# Altium schematic sheet IO.SchDoc: User IO
size A4; Organization: BME AUT; Address1: Magyar tudósok krt. 2.; Address2: Q épület; Address3: Budapest; Address4: H-1117; DocumentNumber: 1; Revision: 1.0; SheetNumber: 1; SheetTotal: 2
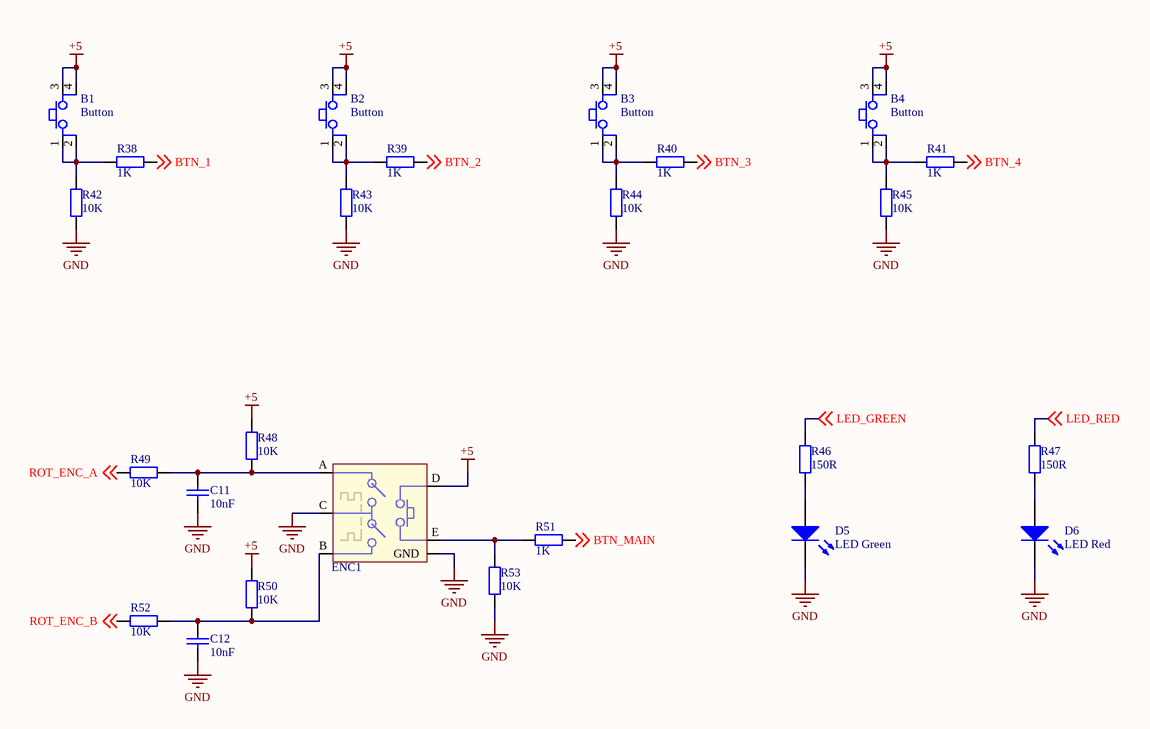
[diagram p0: IO.SchDoc]

## Parts
B1  Button  [FP_BTN_SMD]
B2  Button  [FP_BTN_SMD]
B3  Button  [FP_BTN_SMD]
B4  Button  [FP_BTN_SMD]
C11  10nF  [FP_0805_CAP_085]
C12  10nF  [FP_0805_CAP_085]
D5  LED Green  [FP_0805_LED_RED]
D6  LED Red  [FP_0805_LED_RED]
ENC1  Rotary Encoder  [FP_PEC11S]  (value not drawn)
R38  1K  [FP_0805_RES]
R39  1K  [FP_0805_RES]
R40  1K  [FP_0805_RES]
R41  1K  [FP_0805_RES]
R42  10K  [FP_0805_RES]
R43  10K  [FP_0805_RES]
R44  10K  [FP_0805_RES]
R45  10K  [FP_0805_RES]
R46  150R  [FP_0805_RES]
R47  150R  [FP_0805_RES]
R48  10K  [FP_0805_RES]
R49  10K  [FP_0805_RES]
R50  10K  [FP_0805_RES]
R51  1K  [FP_0805_RES]
R52  10K  [FP_0805_RES]
R53  10K  [FP_0805_RES]

## Nets
+5: B1.3 B1.4 B2.3 B2.4 B3.3 B3.4 B4.3 B4.4 ENC1.D R48.2 R50.2
GND: C11.1 C12.1 D5.K D6.K ENC1.C ENC1.GND R42.1 R43.1 R44.1 R45.1 R53.1
BTN_1: R38.2 ; off-sheet BTN_1
BTN_2: R39.2 ; off-sheet BTN_2
BTN_3: R40.2 ; off-sheet BTN_3
BTN_4: R41.2 ; off-sheet BTN_4
BTN_MAIN: R51.2 ; off-sheet BTN_MAIN
LED_GREEN: R46.2 ; off-sheet LED_GREEN
LED_RED: R47.2 ; off-sheet LED_RED
ROT_ENC_A: R49.1 ; off-sheet ROT_ENC_A
ROT_ENC_B: R52.1 ; off-sheet ROT_ENC_B
NetB1_1: B1.1 B1.2 R38.1 R42.2
NetB2_1: B2.1 B2.2 R39.1 R43.2
NetB3_1: B3.1 B3.2 R40.1 R44.2
NetB4_1: B4.1 B4.2 R41.1 R45.2
NetC11_2: C11.2 ENC1.A R48.1 R49.2
NetC12_2: C12.2 ENC1.B R50.1 R52.2
NetD5_A: D5.A R46.1
NetD6_A: D6.A R47.1
NetENC1_E: ENC1.E R51.1 R53.2

## Notes on the sheet
- Title
- Size:
- Date:
- A4
- Number:
- Time:
- Revision:
- Sheet
- of
- File:

## Library data of the parts
B1-B4 = Button: Push button; Name: TACT 6x 6 4P SPST 1 FSM2JSMA (TYC) 50mA 12VDC SMD H=4.3mm 160g BLACK B. 2-1437565-7; Reference: 45-05-42; Supplier: Lomex
C11 C12 = CAP 10nF: Capacitor; Tolerance: 10%; Voltage: 100V; Name: 10nF 0805 10% 100V X7R 08051C103KAT2A (AVX); Supplier: Lomex; Reference: 82-11-02; Value: 10nF
D5 = LED Green: Green LED; U_fw: 2.2V; I_max: 25mA; Name: 2012 GREEN 568nm 15mcd KP-2012SGC (KIN) W.CLEAR 2x1.2x1.1mm 0805 120°; Wavelength: 568nm; Supplier: Lomex; Reference: 95-01-09
D6 = LED Red: Red LED; U_fw: 1.85V; I_max: 30mA; Name: 2012 RED 640nm 100mcd KP-2012SRC-PRV (KIN) W.CLEAR 2x1.2x1.1mm 0805 120°; Wavelength: 640nm; Supplier: Lomex; Reference: 95-01-68
ENC1 = PEC11S-929K: Encoders 9.5 MM SHAFT W/SWITCH 2 DET; Name: PEC11S-929K-H0015
R38-R41 R51 = RES 1K: Resistor; Tolerance: 5%; Power: 125mW; Name: 1K00 0805 5% WR08X102JTL 0.125W (WAL); Supplier: Lomex; Reference: 81-27-93; Value: 1K
R42-R45 R48-R50 R52 R53 = RES 10K: Resistor; Tolerance: 5%; Power: 125mW; Name: 10K0 0805 5% CR-05JL7---10K 0.125W (VIK); Supplier: Lomex; Reference: 81-30-45; Value: 10K
R46 R47 = RES 150R: Resistor; Tolerance: 5%; Power: 125mW; Name: 150R 0805 5% CR-05JL7--150R 0.125W (VIK); Supplier: Lomex; Reference: 81-10-77; Value: 150R